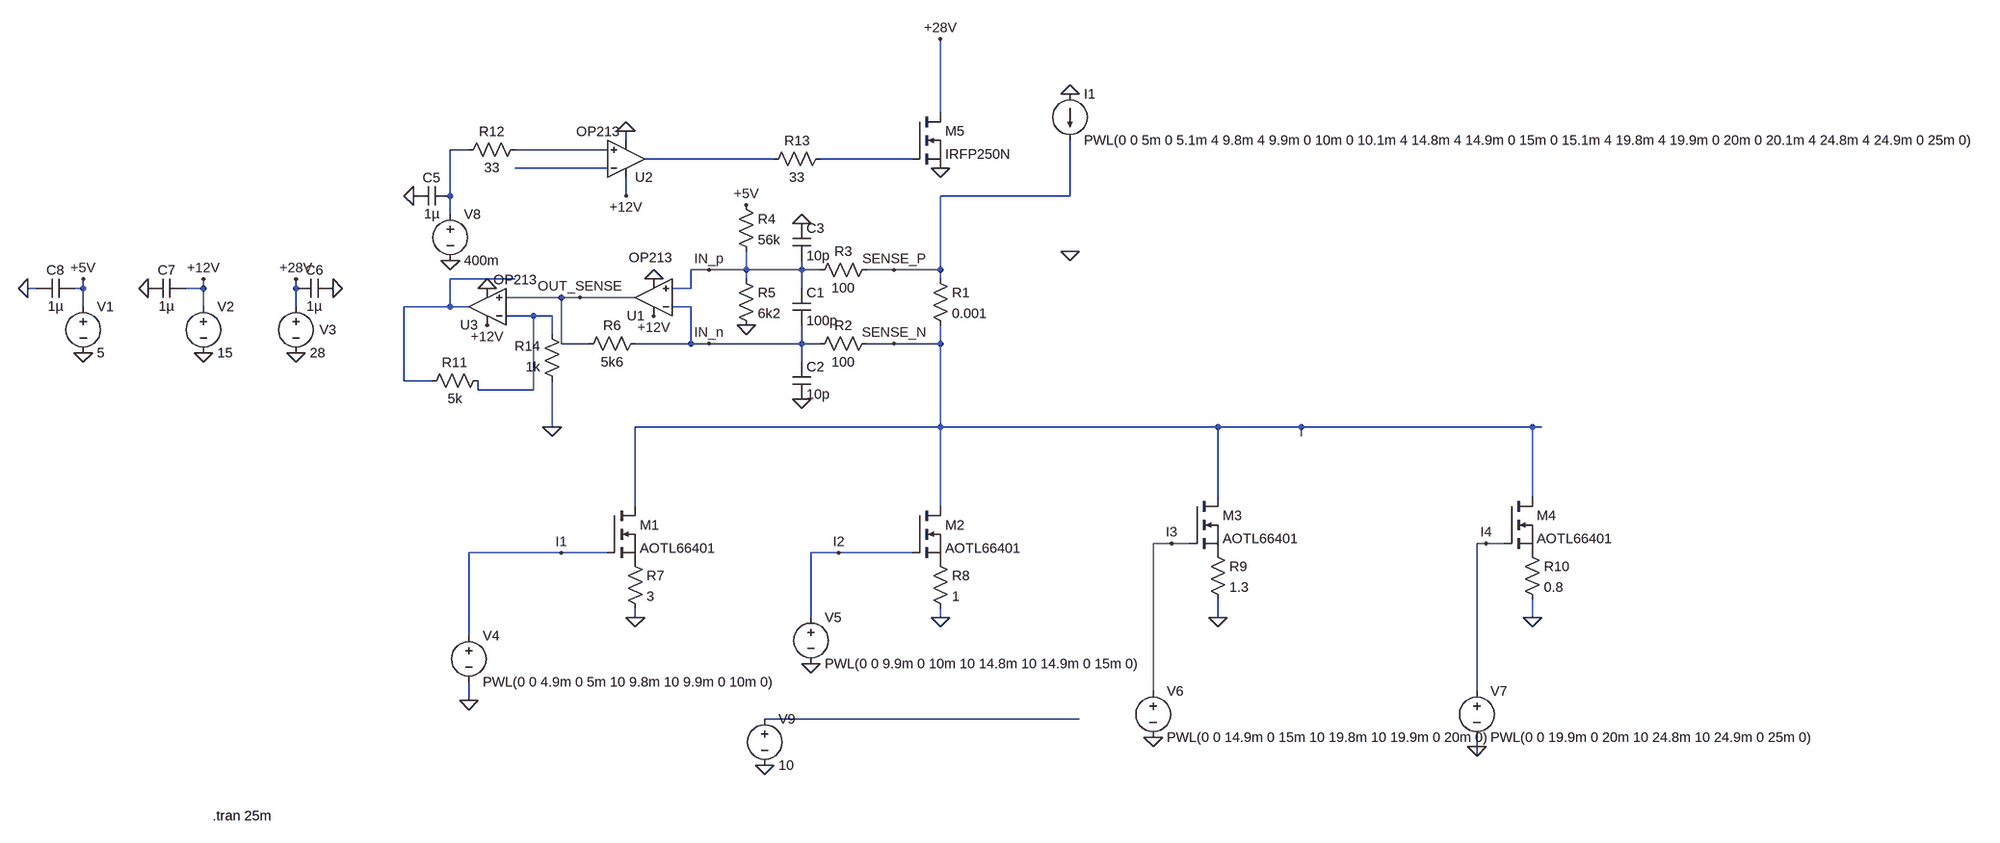
[diagram p0: schematic Ignition.asc]
Ignition.asc, the LTspice schematic file:
Version 4
SHEET 1 2568 680
WIRE 656 -640 656 -768
WIRE 112 -592 112 -608
WIRE -160 -576 -192 -576
WIRE 80 -576 -80 -576
WIRE 368 -560 144 -560
WIRE 608 -560 448 -560
WIRE 80 -544 -80 -544
WIRE 656 -544 656 -560
WIRE -192 -496 -192 -576
WIRE 112 -496 112 -528
WIRE 880 -496 880 -592
WIRE 880 -496 656 -496
WIRE -192 -464 -192 -496
WIRE 256 -368 224 -368
WIRE 320 -368 320 -400
WIRE 320 -368 256 -368
WIRE 416 -368 416 -384
WIRE 416 -368 320 -368
WIRE 448 -368 416 -368
WIRE 576 -368 528 -368
WIRE 656 -368 656 -496
WIRE 656 -368 576 -368
WIRE -80 -352 -192 -352
WIRE 320 -352 320 -368
WIRE 656 -352 656 -368
WIRE -912 -336 -928 -336
WIRE -832 -336 -832 -352
WIRE -832 -336 -848 -336
WIRE -624 -336 -624 -352
WIRE -624 -336 -656 -336
WIRE -464 -336 -464 -352
WIRE 224 -336 224 -368
WIRE 224 -336 192 -336
WIRE 416 -336 416 -368
WIRE 0 -320 -96 -320
WIRE 32 -320 0 -320
WIRE 128 -320 32 -320
WIRE -832 -304 -832 -336
WIRE -624 -304 -624 -336
WIRE -464 -304 -464 -336
WIRE -192 -304 -192 -352
WIRE -192 -304 -272 -304
WIRE -160 -304 -192 -304
WIRE 224 -304 192 -304
WIRE -48 -288 -96 -288
WIRE -16 -288 -48 -288
WIRE -16 -256 -16 -288
WIRE 0 -240 0 -320
WIRE 48 -240 0 -240
WIRE 224 -240 224 -304
WIRE 224 -240 128 -240
WIRE 256 -240 224 -240
WIRE 416 -240 416 -272
WIRE 416 -240 256 -240
WIRE 448 -240 416 -240
WIRE 576 -240 528 -240
WIRE 656 -240 656 -272
WIRE 656 -240 576 -240
WIRE 416 -208 416 -240
WIRE -272 -176 -272 -304
WIRE -224 -176 -272 -176
WIRE -144 -160 -144 -176
WIRE -48 -160 -48 -288
WIRE -48 -160 -144 -160
WIRE -16 -96 -16 -176
WIRE 656 -96 656 -240
WIRE 656 -96 128 -96
WIRE 1136 -96 656 -96
WIRE 1280 -96 1136 -96
WIRE 1680 -96 1280 -96
WIRE 1696 -96 1680 -96
WIRE 1280 -80 1280 -96
WIRE 1136 96 1136 -96
WIRE 1680 96 1680 -96
WIRE 128 112 128 -96
WIRE 656 112 656 -96
WIRE 1056 176 1024 176
WIRE 1088 176 1056 176
WIRE 1600 176 1584 176
WIRE 1632 176 1600 176
WIRE 0 192 -160 192
WIRE 80 192 0 192
WIRE 480 192 432 192
WIRE 608 192 480 192
WIRE 128 304 128 288
WIRE 432 304 432 192
WIRE 656 304 656 288
WIRE 1136 304 1136 272
WIRE 1680 304 1680 272
WIRE -160 336 -160 192
WIRE 1024 432 1024 176
WIRE 1584 432 1584 176
WIRE -160 448 -160 416
WIRE 896 480 352 480
WIRE 1584 528 1584 512
WIRE 1584 544 1584 528
FLAG 160 -352 0
FLAG -832 -352 +5V
FLAG -624 -352 +12V
FLAG -464 -352 +28V
FLAG -832 -224 0
FLAG -624 -224 0
FLAG -464 -224 0
FLAG 128 304 0
FLAG 656 304 0
FLAG 1136 304 0
FLAG 1680 304 0
FLAG -160 448 0
FLAG 432 384 0
FLAG 1024 512 0
FLAG 1584 528 0
FLAG 112 -608 0
FLAG -192 -384 0
FLAG 576 -368 SENSE_P
FLAG 576 -240 SENSE_N
FLAG 32 -320 OUT_SENSE
FLAG 0 192 I1
FLAG 480 192 I2
FLAG 1056 176 I3
FLAG 1600 176 I4
FLAG 352 560 0
FLAG 320 -272 0
FLAG 416 -144 0
FLAG 416 -448 0
FLAG 320 -480 +5V
FLAG 256 -368 IN_p
FLAG 256 -240 IN_n
FLAG 656 -768 +28V
FLAG 880 -672 0
FLAG 160 -288 +12V
FLAG 112 -496 +12V
FLAG -256 -496 0
FLAG -928 -336 0
FLAG -720 -336 0
FLAG -400 -336 0
FLAG 880 -400 0
FLAG -128 -272 +12V
FLAG -128 -336 0
FLAG -16 -96 0
FLAG 656 -544 0
SYMBOL nmos 608 112 R0
SYMATTR InstName M2
SYMATTR Value AOTL66401
SYMBOL nmos 608 -640 R0
SYMATTR InstName M5
SYMATTR Value IRFP250N
SYMBOL OpAmps\\OP213 160 -256 R180
WINDOW 3 -32 133 Left 2
SYMATTR InstName U1
SYMBOL res 640 -368 R0
SYMATTR InstName R1
SYMATTR Value 0.001
SYMBOL res 544 -256 R90
WINDOW 0 0 56 VBottom 2
WINDOW 3 32 56 VTop 2
SYMATTR InstName R2
SYMATTR Value 100
SYMBOL res 544 -384 R90
WINDOW 0 0 56 VBottom 2
WINDOW 3 32 56 VTop 2
SYMATTR InstName R3
SYMATTR Value 100
SYMBOL res 144 -256 R90
WINDOW 0 0 56 VBottom 2
WINDOW 3 32 56 VTop 2
SYMATTR InstName R6
SYMATTR Value 5k6
SYMBOL voltage -832 -320 R0
WINDOW 123 0 0 Left 0
WINDOW 39 24 44 Left 2
SYMATTR InstName V1
SYMATTR Value 5
SYMBOL voltage -624 -320 R0
WINDOW 123 0 0 Left 0
WINDOW 39 24 44 Left 2
SYMATTR InstName V2
SYMATTR Value 15
SYMBOL voltage -464 -320 R0
WINDOW 123 0 0 Left 0
WINDOW 39 24 44 Left 2
WINDOW 0 41 56 Left 2
SYMATTR InstName V3
SYMATTR Value 28
SYMBOL res 112 192 R0
SYMATTR InstName R7
SYMATTR Value 3
SYMBOL res 640 192 R0
SYMATTR InstName R8
SYMATTR Value 1
SYMBOL res 1120 176 R0
SYMATTR InstName R9
SYMATTR Value 1.3
SYMBOL res 1664 176 R0
SYMATTR InstName R10
SYMATTR Value 0.8
SYMBOL voltage -160 320 R0
WINDOW 123 0 0 Left 0
WINDOW 39 0 0 Left 0
SYMATTR InstName V4
SYMATTR Value PWL(0 0 4.9m 0 5m 10 9.8m 10 9.9m 0 10m 0)
SYMBOL voltage 432 288 R0
WINDOW 123 0 0 Left 0
WINDOW 39 0 0 Left 0
SYMATTR InstName V5
SYMATTR Value PWL(0 0 9.9m 0 10m 10 14.8m 10 14.9m 0 15m 0)
SYMBOL voltage 1024 416 R0
WINDOW 123 0 0 Left 0
WINDOW 39 0 0 Left 0
SYMATTR InstName V6
SYMATTR Value PWL(0 0 14.9m 0 15m 10 19.8m 10 19.9m 0 20m 0)
SYMBOL voltage 1584 416 R0
WINDOW 123 0 0 Left 0
WINDOW 39 0 0 Left 0
SYMATTR InstName V7
SYMATTR Value PWL(0 0 19.9m 0 20m 10 24.8m 10 24.9m 0 25m 0)
SYMBOL voltage -192 -480 R0
WINDOW 123 0 0 Left 0
WINDOW 39 24 44 Left 2
SYMATTR InstName V8
SYMATTR Value 400m
SYMBOL voltage 352 464 R0
WINDOW 123 0 0 Left 0
WINDOW 39 0 0 Left 0
SYMATTR InstName V9
SYMATTR Value 10
SYMBOL res 304 -368 R0
SYMATTR InstName R5
SYMATTR Value 6k2
SYMBOL cap 400 -336 R0
SYMATTR InstName C1
SYMATTR Value 100p
SYMBOL cap 400 -208 R0
SYMATTR InstName C2
SYMATTR Value 10p
SYMBOL cap 400 -448 R0
SYMATTR InstName C3
SYMATTR Value 10p
SYMBOL res 304 -496 R0
SYMATTR InstName R4
SYMATTR Value 56k
SYMBOL current 880 -672 R0
WINDOW 123 0 0 Left 0
WINDOW 39 0 0 Left 0
SYMATTR InstName I1
SYMATTR Value PWL(0 0 5m 0 5.1m 4 9.8m 4 9.9m 0 10m 0 10.1m 4 14.8m 4 14.9m 0 15m 0 15.1m 4 19.8m 4 19.9m 0 20m 0 20.1m 4 24.8m 4 24.9m 0 25m 0)
SYMBOL res 464 -576 R90
WINDOW 0 0 56 VBottom 2
WINDOW 3 32 56 VTop 2
SYMATTR InstName R13
SYMATTR Value 33
SYMBOL OpAmps\\OP213 112 -496 M180
WINDOW 3 -86 111 Left 2
SYMATTR InstName U2
SYMBOL res -176 -560 R270
WINDOW 0 32 56 VTop 2
WINDOW 3 0 56 VBottom 2
SYMATTR InstName R12
SYMATTR Value 33
SYMBOL cap -192 -512 R90
WINDOW 0 0 32 VBottom 2
WINDOW 3 32 32 VTop 2
SYMATTR InstName C5
SYMATTR Value 1µ
SYMBOL cap -400 -352 R90
WINDOW 0 0 32 VBottom 2
WINDOW 3 32 32 VTop 2
SYMATTR InstName C6
SYMATTR Value 1µ
SYMBOL cap -656 -352 R90
WINDOW 0 0 32 VBottom 2
WINDOW 3 32 32 VTop 2
SYMATTR InstName C7
SYMATTR Value 1µ
SYMBOL cap -848 -352 R90
WINDOW 0 0 32 VBottom 2
WINDOW 3 32 32 VTop 2
SYMATTR InstName C8
SYMATTR Value 1µ
SYMBOL nmos 80 112 R0
SYMATTR InstName M1
SYMATTR Value AOTL66401
SYMBOL nmos 1088 96 R0
SYMATTR InstName M3
SYMATTR Value AOTL66401
SYMBOL nmos 1632 96 R0
SYMATTR InstName M4
SYMATTR Value AOTL66401
SYMBOL OpAmps\\OP213 -128 -240 R180
WINDOW 3 -86 111 Left 2
SYMATTR InstName U3
SYMBOL res -128 -192 R90
WINDOW 0 0 56 VBottom 2
WINDOW 3 32 56 VTop 2
SYMATTR InstName R11
SYMATTR Value 5k
SYMBOL res 0 -160 R180
WINDOW 0 36 76 Left 2
WINDOW 3 36 40 Left 2
SYMATTR InstName R14
SYMATTR Value 1k
TEXT -608 648 Left 2 !.tran 25m

The netlist it stands for:
* Ignition.asc
M2 SENSE_N I2 P001 P001 AOTL66401
M5 +28V N004 0 0 IRFP250N
XU1 IN_p IN_n +12V 0 OUT_SENSE OP213  ; pins In+ In- V+ V- OUT
R1 SENSE_P SENSE_N 0.001
R2 SENSE_N IN_n 100
R3 SENSE_P IN_p 100
R6 IN_n OUT_SENSE 5k6
V1 +5V 0 5
V2 +12V 0 15
V3 +28V 0 28
R7 P002 0 3
R8 P001 0 1
R9 P003 0 1.3
R10 P004 0 0.8
V4 I1 0 PWL(0 0 4.9m 0 5m 10 9.8m 10 9.9m 0 10m 0)
V5 I2 0 PWL(0 0 9.9m 0 10m 10 14.8m 10 14.9m 0 15m 0)
V6 I3 0 PWL(0 0 14.9m 0 15m 10 19.8m 10 19.9m 0 20m 0)
V7 I4 0 PWL(0 0 19.9m 0 20m 10 24.8m 10 24.9m 0 25m 0)
V8 N001 0 400m
V9 N008 0 10
R5 IN_p 0 6k2
C1 IN_p IN_n 100p
C2 IN_n 0 10p
C3 0 IN_p 10p
R4 +5V IN_p 56k
I1 0 SENSE_P PWL(0 0 5m 0 5.1m 4 9.8m 4 9.9m 0 10m 0 10.1m 4 14.8m 4 14.9m 0 15m 0 15.1m 4 19.8m 4 19.9m 0 20m 0 20.1m 4 24.8m 4 24.9m 0 25m 0)
R13 N004 N003 33
XU2 N002 N005 +12V 0 N003 OP213  ; pins In+ In- V+ V- OUT
R12 N001 N002 33
C5 N001 0 1µ
C6 0 +28V 1µ
C7 +12V 0 1µ
C8 +5V 0 1µ
M1 SENSE_N I1 P002 P002 AOTL66401
M3 SENSE_N I3 P003 P003 AOTL66401
M4 SENSE_N I4 P004 P004 AOTL66401
XU3 OUT_SENSE N007 +12V 0 N006 OP213  ; pins In+ In- V+ V- OUT
R11 N007 N006 5k
R14 0 N007 1k
.model NMOS NMOS
.model PMOS PMOS
.lib standard.mos
.tran 25m
.backanno
.end